# Altium project Gyrophare-CarteDeCommande.PrjPCB
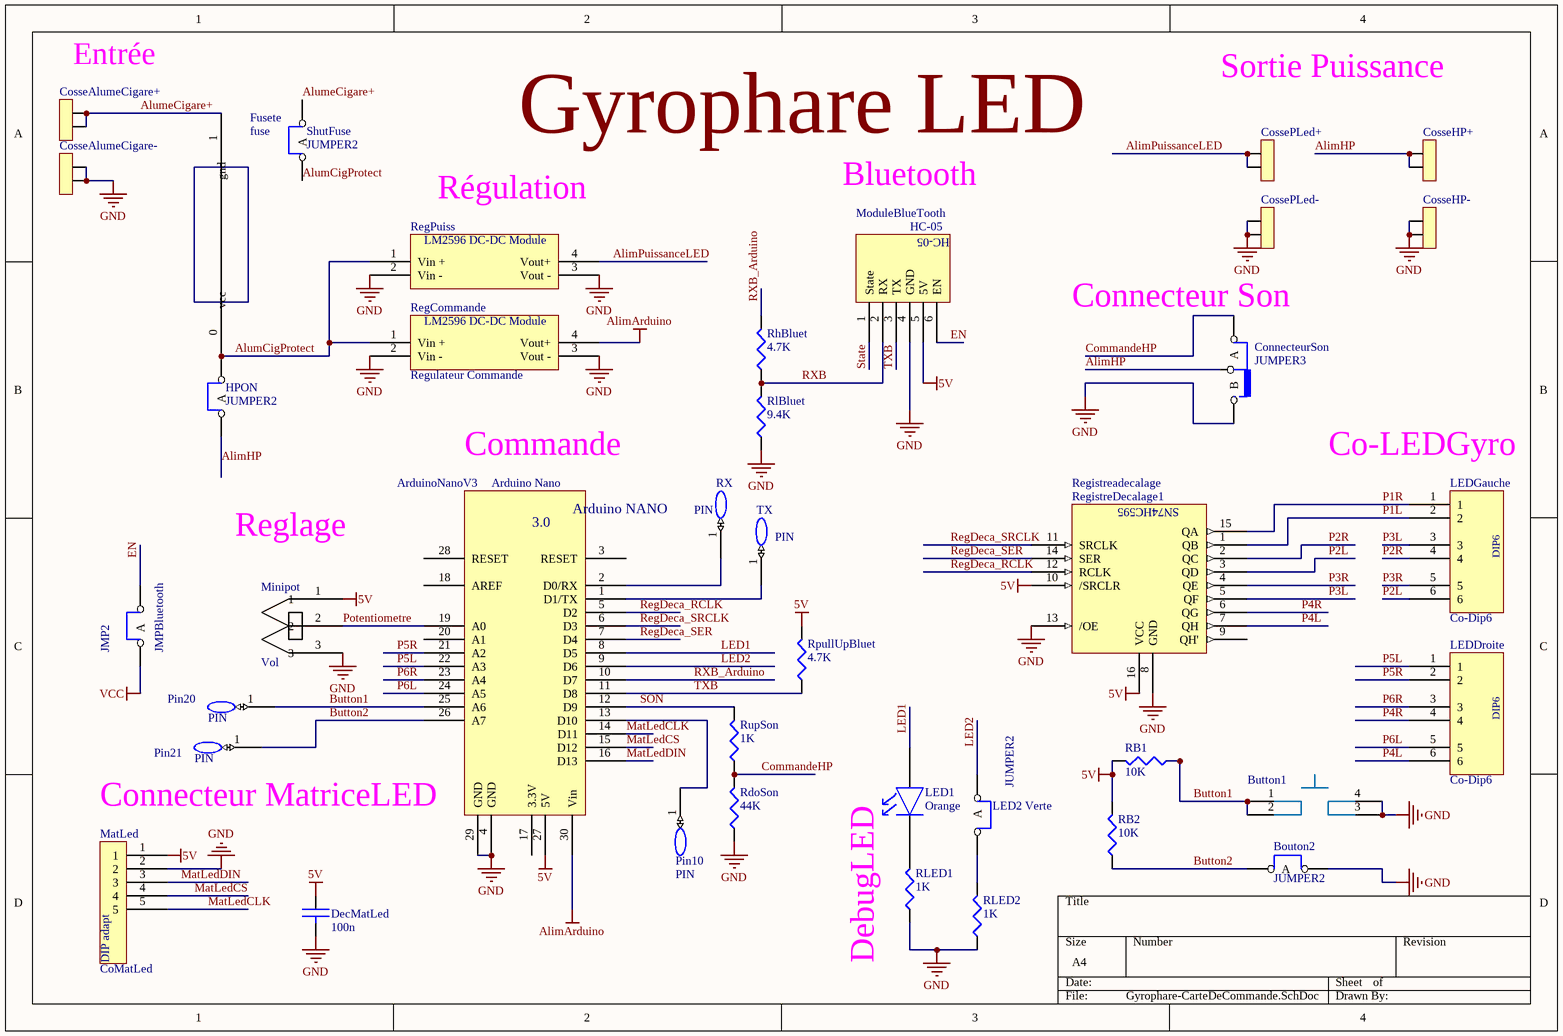
[diagram p0: Gyrophare-CarteDeCommande.SchDoc]
1 sheet, 39 parts. Net scope: global (net labels, ports and power ports of the same name join across sheets).
Board file: Gyrophare-CarteDeCommande.PCBDOC

## Sheet Gyrophare-CarteDeCommande.SchDoc
size A4

### Parts
ArduinoNanoV3  Arduino Nano  [Arduino Nano FootPrint]
Bouton2  JUMPER2  [JMP2-100]
Button1  SwitchButton  [SwitchMedium]  (value not drawn)
ConnecteurSon  JUMPER3  [JMP3-100]
CosseAlumeCigare+  CosseAlumeCigare+  [POWER2]  (value not drawn)
CosseAlumeCigare-  CosseAlumeCigare+  [POWER2]  (value not drawn)
CosseHP+  comment  [POWER2]  (value not drawn)
CosseHP-  comment  [POWER2]  (value not drawn)
CossePLed+  comment  [POWER2]  (value not drawn)
CossePLed-  comment  [POWER2]  (value not drawn)
DecMatLed  value 100n  [0805]  (hidden comment: CAP)
Fusete  fuse  [FUSE]
HPON  JUMPER2  [JMP2-100]
JMPBluetooth  JMP2  [JMP2-100]
LED1  Orange  [LED0805]
LED2_Verte  JUMPER2  [JMP2-100]
LEDDroite  Co-Dip6  [DIP6]
LEDGauche  Co-Dip6  [DIP6]
MatLed  CoMatLed  [ADAPTATEURDIP5]
Minipot  Vol  [MiniTrimer]
ModuleBlueTooth  HC-05  [HC-05 Droit]
Pin10  PIN  [TESTPOINT]
Pin20  PIN  [TESTPOINT]
Pin21  PIN  [TESTPOINT]
RB1  value 10K  [0805]  (hidden comment: RES)
RB2  value 10K  [0805]  (hidden comment: RES)
RdoSon  value 44K  [0805]  (hidden comment: RES)
RegCommande  Regulateur Commande  [Module LM2596 DC-DC]
RegistreDecalage1  Registreadecalage  [74HC595]
RegPuiss  Regulateur Puissant  [Module LM2596 DC-DC]  (value not drawn)
RhBluet  value 4.7K  [0805]  (hidden comment: RES)
RlBluet  value 9.4K  [0805]  (hidden comment: RES)
RLED1  value 1K  [0805]  (hidden comment: RES)
RLED2  value 1K  [0805]  (hidden comment: RES)
RpullUpBluet  value 4.7K  [0805]  (hidden comment: RES)
RupSon  value 1K  [0805]  (hidden comment: RES)
RX  PIN  [TESTPOINT]
ShutFuse  JUMPER2  [JMP2-100]
TX  PIN  [TESTPOINT]

### Nets
5V: ArduinoNanoV3.27(5V) DecMatLed.1 MatLed.1 Minipot.1 ModuleBlueTooth.5(5V) RB1.2 RB2.2 RegistreDecalage1.10(/SRCLR) RegistreDecalage1.16(VCC) RpullUpBluet.2
AlimArduino: ArduinoNanoV3.30(Vin) RegCommande.4(Vout+)
GND: ArduinoNanoV3.4(GND) ArduinoNanoV3.29(GND) Bouton2.2(com) Button1.3 Button1.4 ConnecteurSon.2(B) CosseAlumeCigare-.1 CosseAlumeCigare-.2 CosseHP-.1 CosseHP-.2 CossePLed-.1 CossePLed-.2 DecMatLed.2 MatLed.2 Minipot.3 ModuleBlueTooth.4(GND) RdoSon.1 RegCommande.2(Vin_-) RegCommande.3(Vout_-) RegistreDecalage1.8(GND) RegistreDecalage1.13(/OE) RegPuiss.2(Vin_-) RegPuiss.3(Vout_-) RlBluet.1 RLED1.1 RLED2.1
VCC: JMPBluetooth.1(A)
AlimHP: ConnecteurSon.3(com) CosseHP+.1 CosseHP+.2 HPON.1(A)
AlimPuissanceLED: CossePLed+.1 CossePLed+.2 RegPuiss.4(Vout+)
AlumCigProtect: Fusete.0(vcc) HPON.2(com) RegCommande.1(Vin_+) RegPuiss.1(Vin_+) ShutFuse.1(A)
AlumeCigare+: CosseAlumeCigare+.1 CosseAlumeCigare+.2 Fusete.1(gnd) ShutFuse.2(com)
Button1: ArduinoNanoV3.25(A6) Button1.1 Button1.2 Pin20.1 RB1.1
Button2: ArduinoNanoV3.26(A7) Bouton2.1(A) Pin21.1 RB2.1
CommandeHP: ConnecteurSon.1(A) RdoSon.2 RupSon.1
EN: JMPBluetooth.2(com) ModuleBlueTooth.6(EN)
LED1: ArduinoNanoV3.8(D5) LED1.A
LED2: ArduinoNanoV3.9(D6) LED2_Verte.1(A)
MatLedCLK: ArduinoNanoV3.14(D11) MatLed.5
MatLedCS: ArduinoNanoV3.15(D12) MatLed.4
MatLedDIN: ArduinoNanoV3.16(D13) MatLed.3
P1L: LEDGauche.2 RegistreDecalage1.1(QB)
P1R: LEDGauche.1 RegistreDecalage1.15(QA)
P2L: LEDGauche.6 RegistreDecalage1.3(QD)
P2R: LEDGauche.4 RegistreDecalage1.2(QC)
P3L: LEDGauche.3 RegistreDecalage1.5(QF)
P3R: LEDGauche.5 RegistreDecalage1.4(QE)
P4L: LEDDroite.6 RegistreDecalage1.7(QH)
P4R: LEDDroite.4 RegistreDecalage1.6(QG)
P5L: ArduinoNanoV3.22(A3) LEDDroite.1
P5R: ArduinoNanoV3.21(A2) LEDDroite.2
P6L: ArduinoNanoV3.24(A5) LEDDroite.5
P6R: ArduinoNanoV3.23(A4) LEDDroite.3
Potentiometre: ArduinoNanoV3.19(A0) Minipot.2
RegDeca_RCLK: ArduinoNanoV3.5(D2) RegistreDecalage1.12(RCLK)
RegDeca_SER: ArduinoNanoV3.7(D4) RegistreDecalage1.14(SER)
RegDeca_SRCLK: ArduinoNanoV3.6(D3) RegistreDecalage1.11(SRCLK)
RXB: ModuleBlueTooth.2(RX) RhBluet.1 RlBluet.2
RXB_Arduino: ArduinoNanoV3.10(D7) RhBluet.2
SON: ArduinoNanoV3.12(D9) RupSon.2
State: ModuleBlueTooth.1(State)
TXB: ArduinoNanoV3.11(D8) ModuleBlueTooth.3(TX) RpullUpBluet.1
NetArduinoNanoV3_1: ArduinoNanoV3.1(D1/TX) TX.1
NetArduinoNanoV3_2: ArduinoNanoV3.2(D0/RX) RX.1
NetArduinoNanoV3_13: ArduinoNanoV3.13(D10) Pin10.1
NetLED1_K: LED1.K RLED1.2
NetLED2_Verte_2: LED2_Verte.2(com) RLED2.2

Not connected (* = marked no-connect by the designer): ArduinoNanoV3 3(RESET) 17(3.3V) 18(AREF) 20(A1) 28(RESET); RegistreDecalage1 9(QH')

### Notes on the sheet
- (near CosseAlumeCigare+) Entrée
- Sortie Puissance
- Gyrophare LED
- Régulation
- Bluetooth
- Connecteur Son
- Commande
- (near LEDGauche) Co-LEDGyro
- Reglage
- (near ArduinoNanoV3) Connecteur MatriceLED
- DebugLED
- (in symbol 74HC595) SN74HC595
- (in symbol Arduino Nano) Arduino NANO; 3.0
- (in symbol Co-Dip6) DIP6
- (in symbol Component_1) LM2596 DC-DC Module
- (in symbol DipAdapt5) DIP adapt

### Library data of the parts
Bouton2 HPON JMPBluetooth LED2_Verte ShutFuse = JUMPER2: cavalier 1 position
ConnecteurSon = JUMPER3: cavalier 2 positions
CosseAlumeCigare+ CosseAlumeCigare- CosseHP+ CosseHP- CossePLed+ CossePLed- = POWER2: connecteur alim 2 pôles
DecMatLed = CAP: capacité non polarisée
LED1 = LED: LED 5mm/3mm/CMS
MatLed = DipAdapt5
Minipot = MiniPotentiometre
RB1 RB2 RdoSon RhBluet RlBluet RLED1 RLED2 RpullUpBluet RupSon = RES: resistance
RegCommande RegPuiss = Component_1
RegistreDecalage1 = 74HC595